# Altium schematic sheet DIDO.SchDoc
size A3
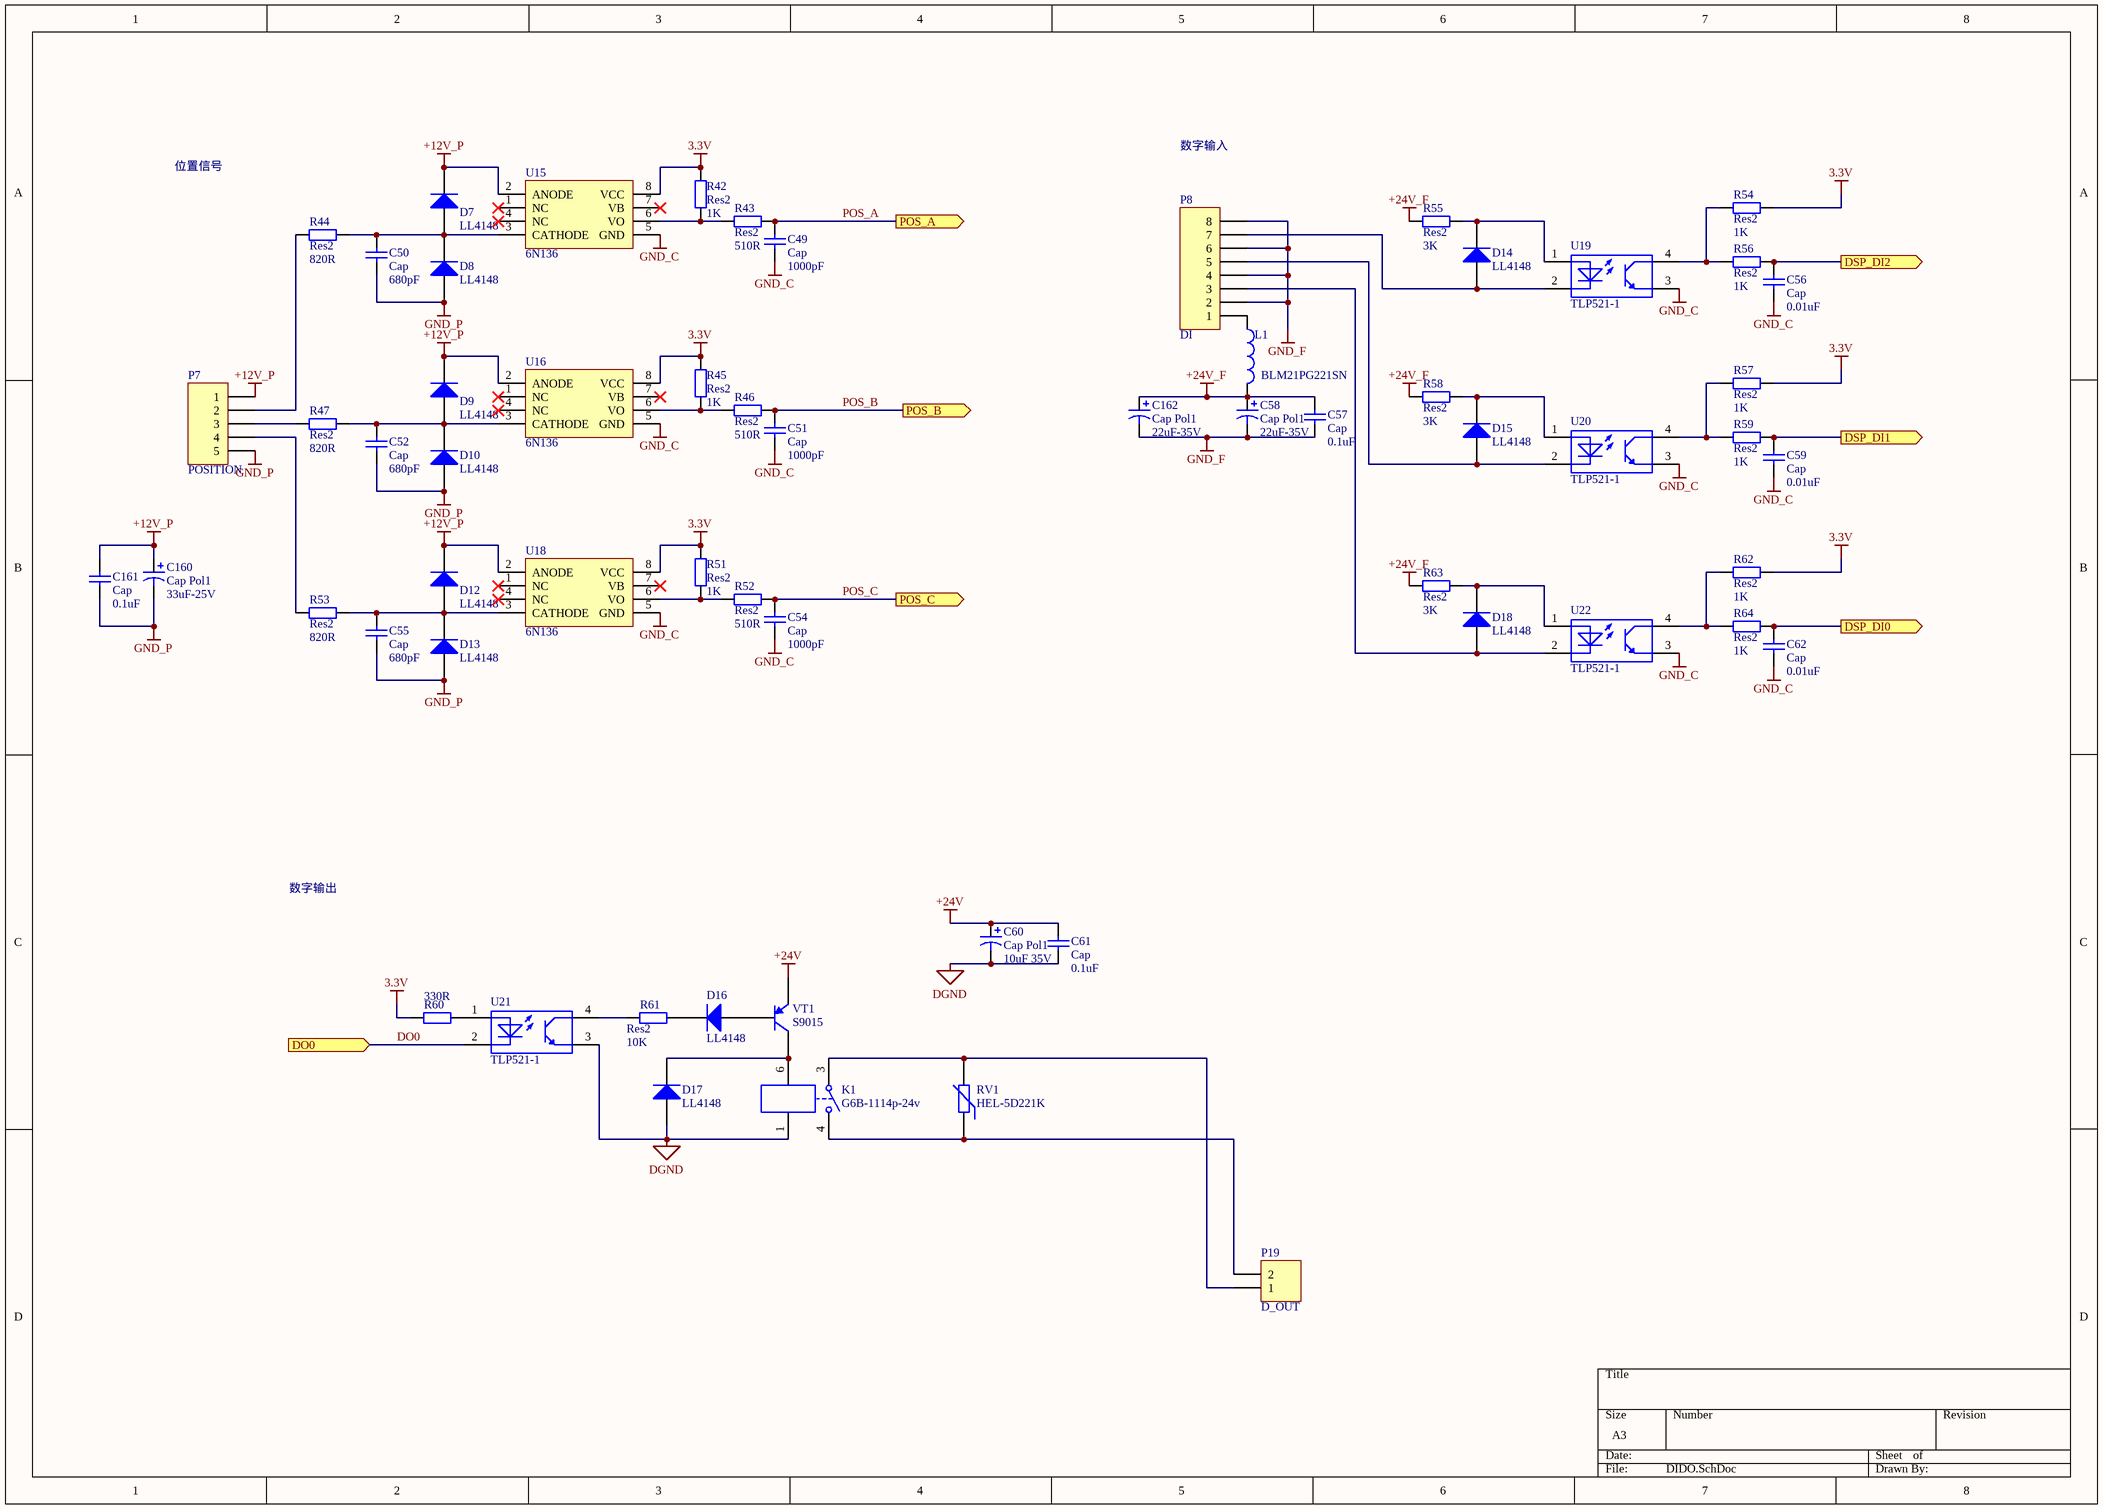
[diagram p0: DIDO.SchDoc]

## Parts
C49  Cap  value 1000pF  [1206]
C50  Cap  value 680pF  [1206]
C51  Cap  value 1000pF  [1206]
C52  Cap  value 680pF  [1206]
C54  Cap  value 1000pF  [1206]
C55  Cap  value 680pF  [1206]
C56  Cap  value 0.01uF  [1206]
C57  Cap  value 0.1uF  [1206]
C58  Cap Pol1  value 22uF-35V  [7343]
C59  Cap  value 0.01uF  [1206]
C60  Cap Pol1  value 10uF 35V  [7343]
C61  Cap  value 0.1uF  [1206]
C62  Cap  value 0.01uF  [1206]
C160  Cap Pol1  value 33uF-25V  [7343]
C161  Cap  value 0.1uF  [1206]
C162  Cap Pol1  value 22uF-35V  [7343]
D7  LL4148  [SOD-80/MLL34]
D8  LL4148  [SOD-80/MLL34]
D9  LL4148  [SOD-80/MLL34]
D10  LL4148  [SOD-80/MLL34]
D12  LL4148  [SOD-80/MLL34]
D13  LL4148  [SOD-80/MLL34]
D14  LL4148  [SOD-80/MLL34]
D15  LL4148  [SOD-80/MLL34]
D16  LL4148  [SOD-80/MLL34]
D17  LL4148  [SOD-80/MLL34]
D18  LL4148  [SOD-80/MLL34]
K1  G6B-1114p-24v  [SPST-NO]
L1  BLM21PG221SN  [2012]
P7  POSITION  [phenox-5]
P8  DI  [phenox-8]
P19  D_OUT  [phenox-2]
R42  Res2  value 1K  [1206]
R43  Res2  value 510R  [1206]
R44  Res2  value 820R  [1206]
R45  Res2  value 1K  [1206]
R46  Res2  value 510R  [1206]
R47  Res2  value 820R  [1206]
R51  Res2  value 1K  [1206]
R52  Res2  value 510R  [1206]
R53  Res2  value 820R  [1206]
R54  Res2  value 1K  [1206]
R55  Res2  value 3K  [1206]
R56  Res2  value 1K  [1206]
R57  Res2  value 1K  [1206]
R58  Res2  value 3K  [1206]
R59  Res2  value 1K  [1206]
R60  value 330R  [1206]  (hidden comment: Res2)
R61  Res2  value 10K  [1206]
R62  Res2  value 1K  [1206]
R63  Res2  value 3K  [1206]
R64  Res2  value 1K  [1206]
RV1  HEL-5D221K  [RAD-0.2]
U15  6N136  [DIP-8N]
U16  6N136  [DIP-8N]
U18  6N136  [DIP-8N]
U19  TLP521-1  [DIP4]
U20  TLP521-1  [DIP4]
U21  TLP521-1  [DIP4]
U22  TLP521-1  [DIP4]
VT1  S9015  [SOT23]

## Ports
DO0 (in), DSP_DI0 (out), DSP_DI1 (out), DSP_DI2 (out), POS_A (out), POS_B (out), POS_C (out)

## Nets
3.3V: R42.2 R45.2 R51.2 R54.2 R57.2 R60.1 R62.2 U15.8(VCC) U16.8(VCC) U18.8(VCC)
+12V_P: C160.1 C161.2 D7.2(K) D9.2(K) D12.2(K) P7.1 U15.2(ANODE) U16.2(ANODE) U18.2(ANODE)
+24V: C60.1 C61.2 VT1.3
+24V_F: C57.2 C58.1 C162.1 L1.2 R55.1 R58.1 R63.1
DGND: C60.2 C61.1 D17.1(A) K1.1 U21.3
GND_C: C49.1 C51.1 C54.1 C56.1 C59.1 C62.1 U15.5(GND) U16.5(GND) U18.5(GND) U19.3 U20.3 U22.3
GND_F: C57.1 C58.2 C162.2 P8.2 P8.4 P8.6 P8.8
GND_P: C50.1 C52.1 C55.1 C160.2 C161.1 D8.1(A) D10.1(A) D13.1(A) P7.5
DO0: U21.2 ; port DO0
DSP_DI0: C62.2 R64.2 ; port DSP_DI0
DSP_DI1: C59.2 R59.2 ; port DSP_DI1
DSP_DI2: C56.2 R56.2 ; port DSP_DI2
POS_A: C49.2 R43.2 ; port POS_A
POS_B: C51.2 R46.2 ; port POS_B
POS_C: C54.2 R52.2 ; port POS_C
NetC50_2: C50.2 D7.1(A) D8.2(K) R44.2 U15.3(CATHODE)
NetC52_2: C52.2 D9.1(A) D10.2(K) R47.2 U16.3(CATHODE)
NetC55_2: C55.2 D12.1(A) D13.2(K) R53.2 U18.3(CATHODE)
NetD14_1: D14.1(A) P8.7 U19.2
NetD14_2: D14.2(K) R55.2 U19.1
NetD15_1: D15.1(A) P8.5 U20.2
NetD15_2: D15.2(K) R58.2 U20.1
NetD16_1: D16.1(A) VT1.2
NetD16_2: D16.2(K) R61.2
NetD17_2: D17.2(K) K1.6 VT1.1
NetD18_1: D18.1(A) P8.3 U22.2
NetD18_2: D18.2(K) R63.2 U22.1
NetK1_3: K1.3 P19.1 RV1.2
NetK1_4: K1.4 P19.2 RV1.1
NetL1_1: L1.1 P8.1
NetP7_2: P7.2 R44.1
NetP7_3: P7.3 R47.1
NetP7_4: P7.4 R53.1
NetR42_1: R42.1 R43.1 U15.6(VO)
NetR45_1: R45.1 R46.1 U16.6(VO)
NetR51_1: R51.1 R52.1 U18.6(VO)
NetR54_1: R54.1 R56.1 U19.4
NetR57_1: R57.1 R59.1 U20.4
NetR60_2: R60.2 U21.1
NetR61_1: R61.1 U21.4
NetR62_1: R62.1 R64.1 U22.4

Not connected (* = marked no-connect by the designer): U15 1(NC)* 4(NC)* 7(VB)*; U16 1(NC)* 4(NC)* 7(VB)*; U18 1(NC)* 4(NC)* 7(VB)*

## Notes on the sheet
- 位置信号
- 数字输入
- 数字输出

## Library data of the parts
C49-C52 C54-C57 C59 C61 C62 C161 = Cap: Capacitor; Published: 8-Jun-2000; LatestRevisionDate: 17-Jul-2002; LatestRevisionNote: Re-released for DXP Platform.; PackageReference: RAD-0.3; Publisher: Altium Limited
C58 C60 C160 C162 = Cap Pol1: Polarized Capacitor (Radial); Published: 8-Jun-2000; LatestRevisionDate: 17-Jul-2002; LatestRevisionNote: Re-released for DXP Platform.; PackageReference: RB7.6-15; Publisher: Altium Limited
D7-D10 D12 D13 D16 = Diode 1N4148: High Conductance Fast Diode; Published: 8-Jun-2000; LatestRevisionDate: 17-Jul-2002; LatestRevisionNote: Re-released for DXP Platform.; DatasheetVersion: 1997; PackageReference: DO-35; Publisher: Altium Limited; Code_JEDEC: DO-204-AH; ComponentLink1Description: Manufacturer Link; ComponentLink1URL: http://www.fairchildsemi.com/; ComponentLink2Description: Datasheet; ComponentLink2URL: http://www.fairchildsemi.com/ds/1N%2F1N4148.pdf
D14 D15 D17 D18 = Diode 1N4007: 1 Amp General Purpose Rectifier; Published: 8-Jun-2000; LatestRevisionDate: 17-Jul-2002; LatestRevisionNote: Re-released for DXP Platform.; DatasheetVersion: 1998; PackageVersion: Aug-1999; PackageReference: DO-41; Publisher: Altium Limited; Code_JEDEC: DO-204-AL; ComponentLink1Description: Manufacturer Link; ComponentLink1URL: http://www.fairchildsemi.com/; ComponentLink2Description: Datasheet; ComponentLink2URL: http://www.fairchildsemi.com/ds/1N%2F1N4001.pdf
K1 = Relay-SPST: Single-Pole Single-Throw Relay; Published: 24-Mar-1999; LatestRevisionDate: 17-Jul-2002; LatestRevisionNote: Re-released for DXP Platform.; PackageReference: MODULE4; Publisher: Altium Limited
L1 = Inductor: Code_IEC: 1005; Value: 10mH; Published: 8-Jun-2000; LatestRevisionDate: 29-May-2009; LatestRevisionNote: IPC-7351 Footprint Added.; PackageReference: 0402-A; Publisher: Altium Limited; PackageDescription: Chip Inductor; Code_JEITA: 0402
P7 = Header 5: Header, 5-Pin; LatestRevisionDate: 17-Jul-2002; LatestRevisionNote: Re-released for DXP Platform.; Publisher: Altium Limited
P8 = Header 8: Header, 8-Pin; LatestRevisionDate: 17-Jul-2002; LatestRevisionNote: Re-released for DXP Platform.; Publisher: Altium Limited
P19 = Header 2: Header, 2-Pin; LatestRevisionDate: 17-Jul-2002; LatestRevisionNote: Re-released for DXP Platform.; Publisher: Altium Limited
R42-R47 R51-R64 = Res2: Resistor; Published: 8-Jun-2000; LatestRevisionDate: 17-Jul-2002; LatestRevisionNote: Re-released for DXP Platform.; PackageReference: AXIAL-0.4; Publisher: Altium Limited
U15 U16 U18 = 6N136: 光耦